# EAGLE schematic Flight Controller (EAGLE 9.1.0)
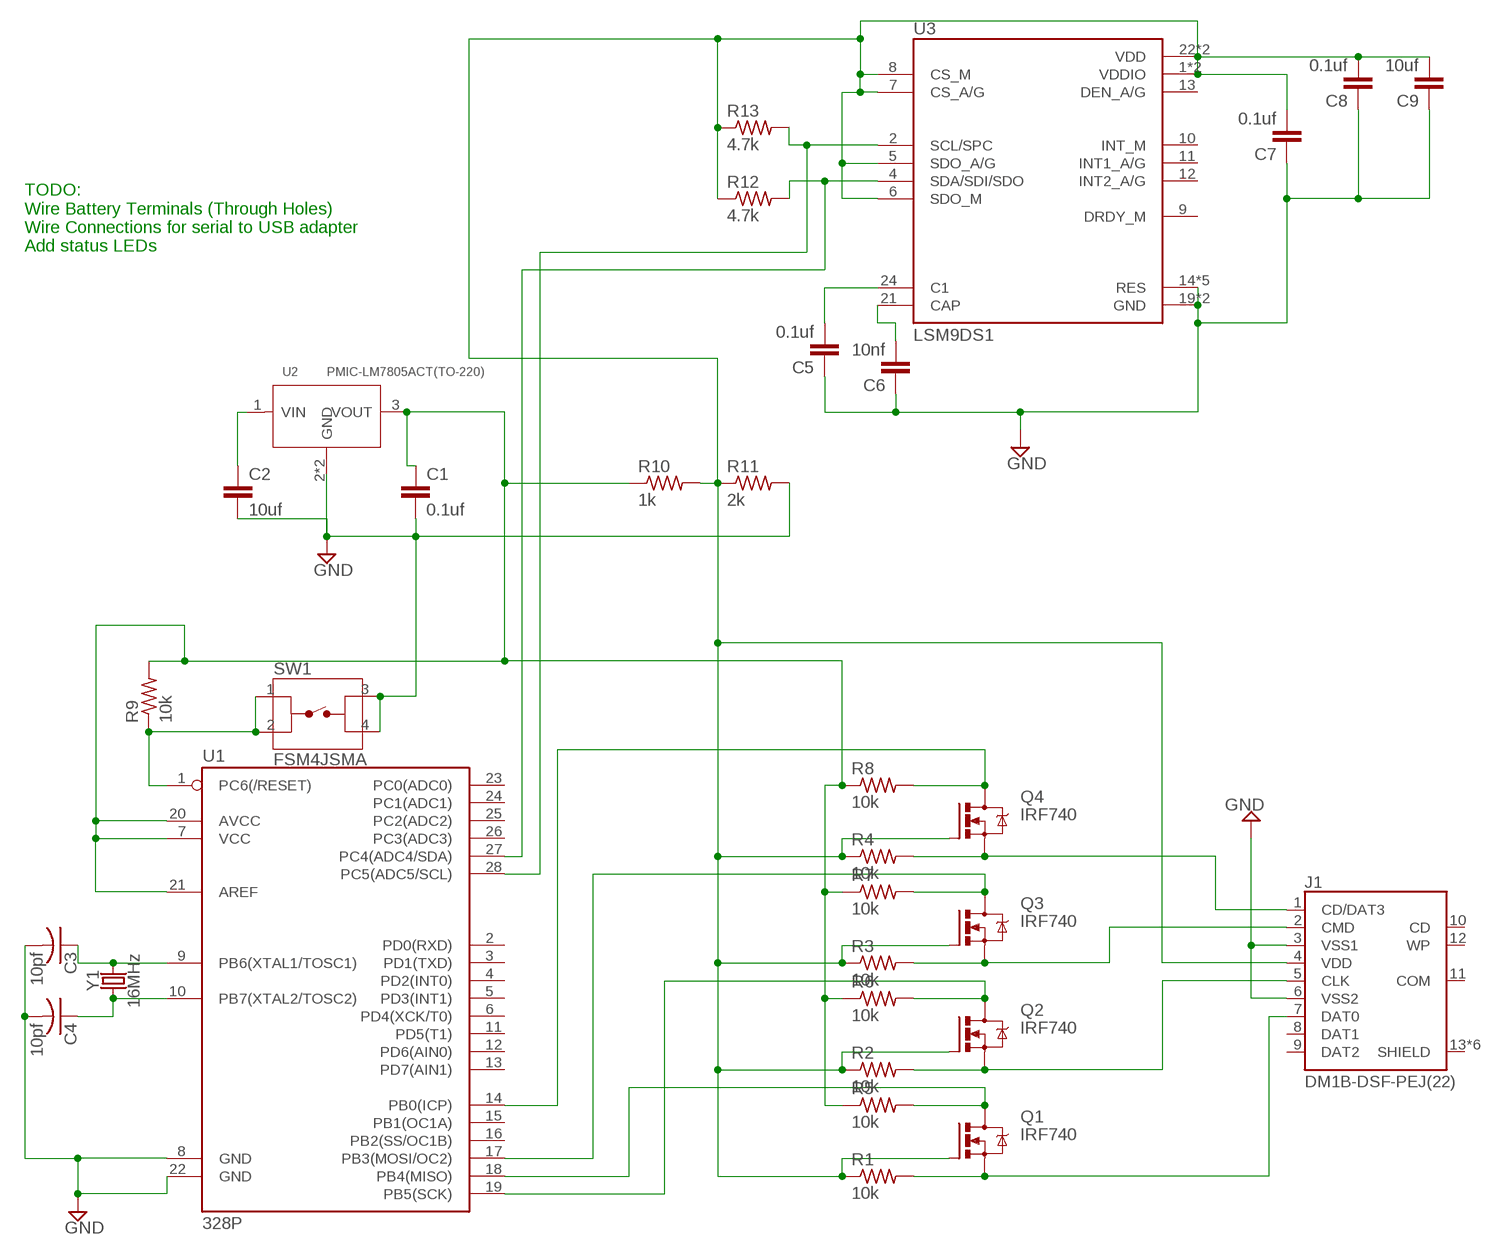
[diagram p0: schematic, sheet 1]

## Parts
C1  0.1uf  C5/3.5  [C5B3.5]
C2  10uf  C5/3.5  [C5B3.5]
C3  10pf  C-US025-025X050  [C025-025X050]
C4  10pf  C-US025-025X050  [C025-025X050]
C5  0.1uf  C5/3.5  [C5B3.5]
C6  10nf  C5/3.5  [C5B3.5]
C7  0.1uf  C5/3.5  [C5B3.5]
C8  0.1uf  C5/3.5  [C5B3.5]
C9  10uf  C5/3.5  [C5B3.5]
J1  DM1B-DSF-PEJ(22)  [HRS_DM1B-DSF-PEJ(22)]
Q1  IRF740  [TO220BV]
Q2  IRF740  [TO220BV]
Q3  IRF740  [TO220BV]
Q4  IRF740  [TO220BV]
R1  10k  R-US_0204/7  [0204/7]
R2  10k  R-US_0204/7  [0204/7]
R3  10k  R-US_0204/7  [0204/7]
R4  10k  R-US_0204/7  [0204/7]
R5  10k  R-US_0204/7  [0204/7]
R6  10k  R-US_0204/7  [0204/7]
R7  10k  R-US_0204/7  [0204/7]
R8  10k  R-US_0204/7  [0204/7]
R9  10k  R-US_0207/7  [0207/7]
R10  1k  R-US_0204/7  [0204/7]
R11  2k  R-US_0204/7  [0204/7]
R12  4.7k  R-US_0204/7  [0204/7]
R13  4.7k  R-US_0204/7  [0204/7]
SW1  FSM4JSMA  [TE_FSM4JSMA]
U1  328P  ATMEGA328P_PDIP  [DIP28]
U2  PMIC-LM7805ACT(TO-220)  [TO-220]
U3  LSM9DS1  [PQFN24P43_350X300X102L35X23N]
Y1  16MHz  CRYSTAL-16MHZPTH-HC49US  [HC49US]

## Nets
GND: C1.2 C2.2 C3.2 C4.2 C5.1 C6.1 C7.1 C8.1 C9.1 J1.3(VSS1) J1.6(VSS2) R11.2 SW1.3 SW1.4 U1.8(GND) U1.22(GND) U2.2(GND) U2.HEAT(GND) U3.14(RES) U3.15(RES) U3.16(RES) U3.17(RES) U3.18(RES) U3.19(GND) U3.20(GND)
N$1: J1.7(DAT0) Q1.S R1.2
N$2: C5.2 U3.24(C1)
N$3: Q1.D R5.2 U1.18(PB4(MISO))
N$4: C2.1 U2.1(VIN)
N$5: C1.1 R5.1 R6.1 R7.1 R8.1 R9.2 R10.1 U1.7(VCC) U1.20(AVCC) U1.21(AREF) U2.3(VOUT)
N$6: C6.2 U3.21(CAP)
N$7: C3.1 U1.9(PB6(XTAL1/TOSC1)) Y1.2
N$8: C4.1 U1.10(PB7(XTAL2/TOSC2)) Y1.1
N$9: R12.2 U1.27(PC4(ADC4/SDA)) U3.4(SDA/SDI/SDO)
N$10: R9.1 SW1.1 SW1.2 U1.1(PC6(/RESET))
N$11: J1.5(CLK) Q2.S R2.2
N$13: Q2.D R6.2 U1.19(PB5(SCK))
N$14: J1.2(CMD) Q3.S R3.2
N$15: R13.2 U1.28(PC5(ADC5/SCL)) U3.2(SCL/SPC)
N$16: Q3.D R7.2 U1.17(PB3(MOSI/OC2))
N$17: J1.1(CD/DAT3) Q4.S R4.2
N$18: C7.2 C8.2 C9.2 J1.4(VDD) Q1.G Q2.G Q3.G Q4.G R1.1 R2.1 R3.1 R4.1 R10.2 R11.1 R12.1 R13.1 U3.1(VDDIO) U3.3(VDDIO) U3.5(SDO_A/G) U3.6(SDO_M) U3.7(CS_A/G) U3.8(CS_M) U3.22(VDD) U3.23(VDD)
N$19: Q4.D R8.2 U1.14(PB0(ICP))
Unconnected: J1.8(DAT1) J1.9(DAT2) J1.10(CD) J1.11(COM) J1.12(WP) J1.13(SHIELD) J1.14(SHIELD) J1.15(SHIELD) J1.16(SHIELD) J1.17(SHIELD) J1.18(SHIELD) U1.2(PD0(RXD)) U1.3(PD1(TXD)) U1.4(PD2(INT0)) U1.5(PD3(INT1)) U1.6(PD4(XCK/T0)) U1.11(PD5(T1)) U1.12(PD6(AIN0)) U1.13(PD7(AIN1)) U1.15(PB1(OC1A)) U1.16(PB2(SS/OC1B)) U1.23(PC0(ADC0)) U1.24(PC1(ADC1)) U1.25(PC2(ADC2)) U1.26(PC3(ADC3)) U3.9(DRDY_M) U3.10(INT_M) U3.11(INT1_A/G) U3.12(INT2_A/G) U3.13(DEN_A/G)

## Notes on the sheet
- TODO: 
  Wire Battery Terminals (Through Holes)
  Wire Connections for serial to USB adapter
  Add status LEDs

## Library data of the parts
C1 C2 C5-C9 = capacitor-wima:C: CAPACITOR naming: grid - package width
C3 C4 = rcl:C-US: CAPACITOR, American symbol; SPICEPREFIX: C
J1 = DM1B-DSF-PEJ_22_:DM1B-DSF-PEJ(22): DM1 Series 9 Position 2.9 mm Height SMT SD Memory Card; DESCRIPTION: DM1 Series 9 Position 2.9 mm Height SMT SD Memory Card; DIGI-KEY_PART_NUMBER: HR846CT-ND; DIGI-KEY_PURCHASE_URL: https://www.digikey.ca/product-detail/en/hirose-electric-co-ltd/DM1B-DSF-PEJ_22_/HR846CT-ND/559986?utm_source=snapeda&utm_medium=aggregator&utm_campaign=symbol; MF: Hirose; MP: DM1B-DSF-PEJ_22_; PACKAGE: None
Q1-Q4 = transistor-power:IRF740: N-CHANNEL MOS FET
R1-R13 = resistor:R-US_: RESISTOR, American symbol
SW1 = FSM4JSMA:FSM4JSMA: Switch Tactile OFF (ON) SPST Round Button Gull Wing 0.05A 24VDC 2.6N SMD T/R; COMMENT: 4-1437565-1; CONFIGURATION_POLE-THROW: Single Pole - Single Throw; CONTACT_CURRENT_RATING: 50 mA; DESCRIPTION: FSM4JSMA=SMT,TACTILE,PB SWITCH; DIGI-KEY_PART_NUMBER: 450-1129-ND; DIGI-KEY_PURCHASE_URL: https://www.digikey.ca/product-detail/en/te-connectivity-alcoswitch-switches/FSM4JSMA/450-1129-ND/525821?utm_source=snapeda&utm_medium=aggregator&utm_campaign=symbol; EU_ROHS_COMPLIANCE: Compliant; MF: TE Connectivity; MP: FSM4JSMA; PACKAGE: None; TE_PURCHASE_URL: https://www.te.com/usa-en/product-4-1437565-1.html?te_bu=Cor&te_type=disp&te_campaign=seda_glo_cor-seda-global-disp-prtnr-fy19-seda-model-bom-cta_sma-317_1&elqCampaignId=32493
U1 = SparkFun-IC-Microcontroller:ATMEGA328P_PDIP: Atmel 328P Through hole ATMEGA328P uC used in the Arduino 32kb flash, 1k EEPROM, 2k SRAM Datasheet <http://www.sparkfun.com/datasheets/Components/SMD/ATMega328.pdf> SparkFun Products Storefront component: AVR 28 Pin 20MHz 32K 6A/D - ATMega328P <https://www.sparkfun.com/products/9061> (COM-09061) SparkFun Simon Says - Through-Hole Soldering Kit <https://www.sparkfun.com/products/10547> (KIT-10547) SparkFun Learn to Solder - Simon Says <https://www.sparkfun.com/products/13708> (KIT-13708) SparkFun BigTime Watch Kit <https://www.sparkfun.com/products/11734> (KIT-11734) SparkFun ClockIt <https://www.sparkfun.com/products/10930> (KIT-10930) SparkFun Serial Enabled LCD Kit <https://www.sparkfun.com/products/10097> (LCD-10097) SparkFun Simon Tilts - Through Hole Soldering Kit <https://www.sparkfun.com/products/12634> (KIT-12634) SparkFun Frequency Counter Kit <https://www.sparkfun.com/products/10140> (KIT-10140) FabFM Radio Kit <https://www.sparkfun.com/products/11043> (KIT-11043) SparkFun Binary Blaster Kit <https://www.sparkfun.com/products/12037> (KIT-12037) SparkFun Metro-Gnome <https://www.sparkfun.com/products/9236> (KIT-09236) ATmega328 with Arduino Optiboot (Uno) <https://www.sparkfun.com/products/10524> (DEV-10524); PROD_ID: IC-09136
U2 = PMIC-LM7805ACT_TO-220_:PMIC-LM7805ACT(TO-220): 310030049; DESCRIPTION: LM78XXA Series 5 V Fixed Output 1 A 3-Terminal LDO Voltage Regulator - TO-220; DIGI-KEY_PART_NUMBER: LM7805ACT-ND; DIGI-KEY_PURCHASE_URL: https://www.digikey.ca/product-detail/en/on-semiconductor/LM7805ACT/LM7805ACT-ND/1626089?utm_source=snapeda&utm_medium=aggregator&utm_campaign=symbol; MF: ON Semiconductor; MP: LM7805ACT; PACKAGE: TO-220 ON Semiconductor
U3 = LSM9DS1:LSM9DS1: iNEMO inertial module: 3D accelerometer, 3D gyroscope, 3D magnetometer; AVAILABILITY: Unavailable; DESCRIPTION: iNEMO inertial module: 3D accelerometer, 3D gyroscope, 3D magnetometer; MF: SparkFun Electronics; MP: LSM9DS1; PACKAGE: None; PRICE: None
Y1 = SparkFun-Clocks:CRYSTAL-16MHZ: 16MHz Crystal Digikey Example <http://www.digikey.com/product-search/en?keywords=535-9122-1-ND> Frequency: 16MHz Frequency Stability: ±50ppm Frequency Tolerance: ±20ppm Load Capacitance: 18pF SparkFun Products: Pro Micro -5V/16MHz <https://www.sparkfun.com/products/12640> SparkFun Serial Enabled LCD Kit <https://www.sparkfun.com/products/10097>; PROD_ID: XTAL-08181; SF_ID: COM-00536